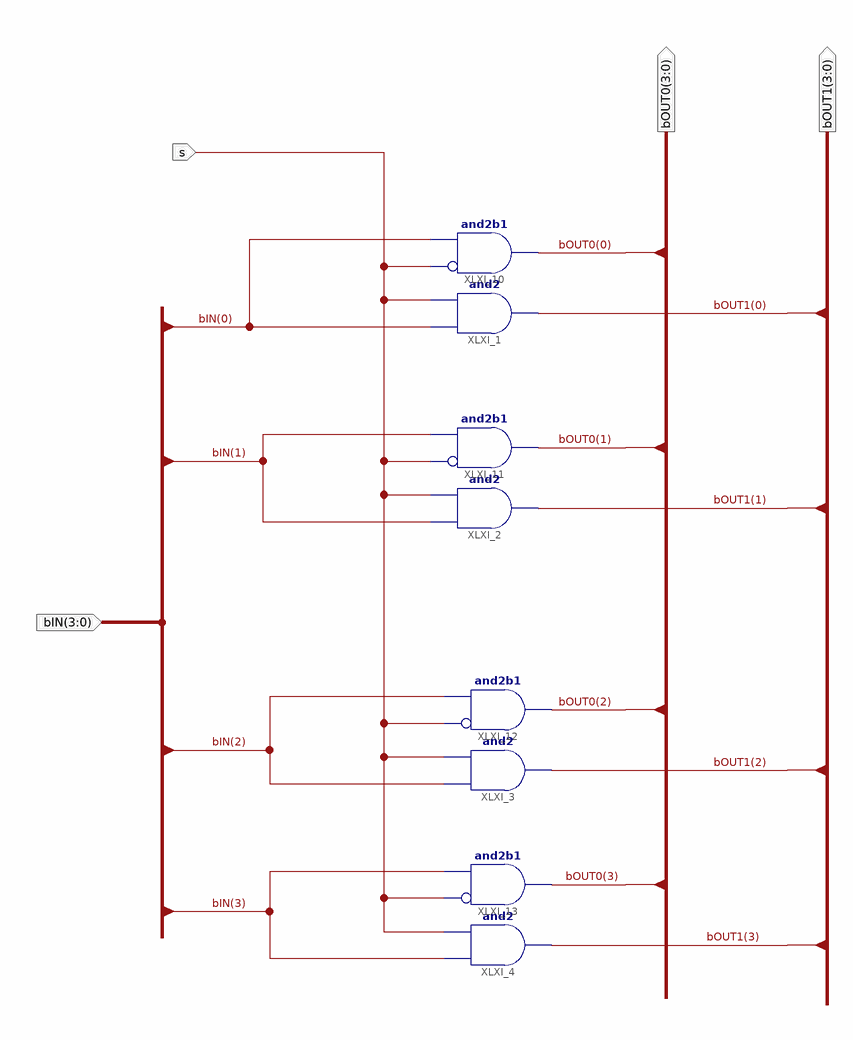
[diagram p0: schematic sheet 1]
// Xilinx ISE schematic Demux4b.sch (spartan3e) as structural Verilog: 8 symbols, 4 ports
module Demux4b (
  input  [3:0] bIN,
  input  s,
  output [3:0] bOUT0,
  output [3:0] bOUT1
);

  and XLXI_2 (bOUT1[1], bIN[1], s);
  and XLXI_11 (bOUT0[1], ~s, bIN[1]);  // and2b1
  and XLXI_3 (bOUT1[2], bIN[2], s);
  and XLXI_12 (bOUT0[2], ~s, bIN[2]);  // and2b1
  and XLXI_4 (bOUT1[3], bIN[3], s);
  and XLXI_13 (bOUT0[3], ~s, bIN[3]);  // and2b1
  and XLXI_1 (bOUT1[0], bIN[0], s);
  and XLXI_10 (bOUT0[0], ~s, bIN[0]);  // and2b1
endmodule
